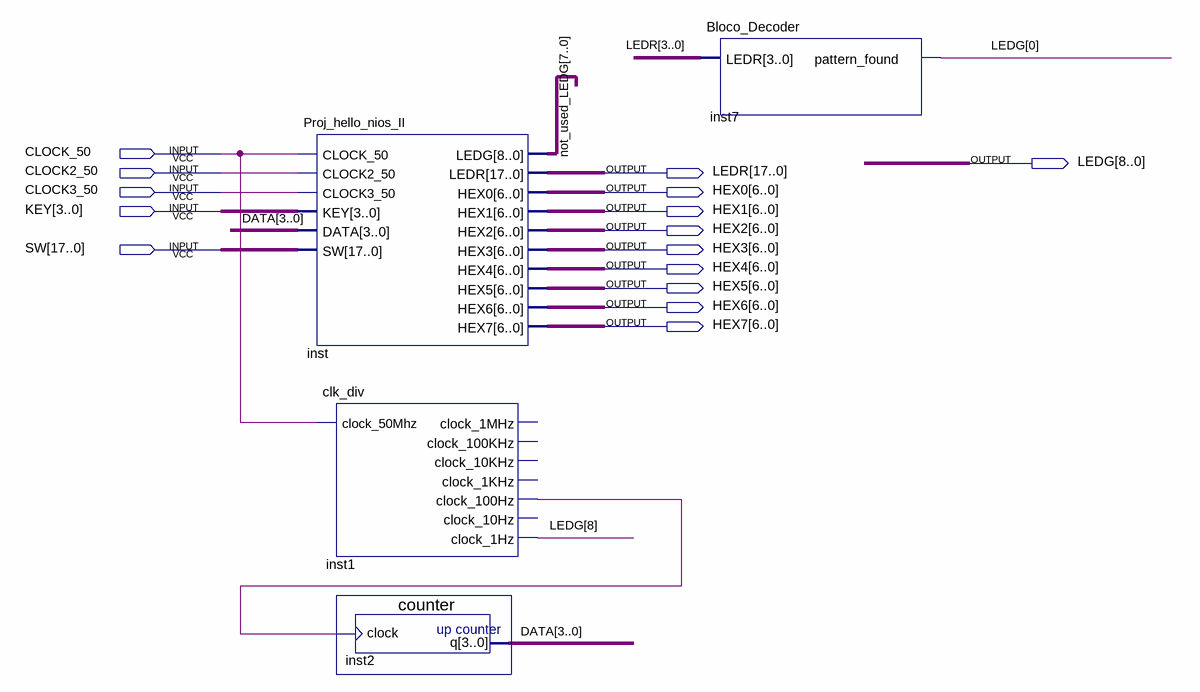
[diagram p0: schematic sheet]
// Quartus schematic Bloco_NiosII.bdf as structural Verilog: 4 symbols, 15 pins
module Bloco_NiosII (
  input  CLOCK_50,
  input  CLOCK2_50,
  input  CLOCK3_50,
  input  [3:0] KEY,
  input  [17:0] SW,
  output [8:0] LEDG,
  output [17:0] LEDR,
  output [6:0] HEX0,
  output [6:0] HEX1,
  output [6:0] HEX2,
  output [6:0] HEX3,
  output [6:0] HEX4,
  output [6:0] HEX5,
  output [6:0] HEX6,
  output [6:0] HEX7
);

  wire inst1_clock_10hz, inst1_clock_100hz;
  wire [3:0] DATA;
  wire [7:0] not_used_LEDG;

  Proj_hello_nios_II inst (
    .CLOCK_50(CLOCK_50), .CLOCK2_50(CLOCK2_50), .CLOCK3_50(CLOCK3_50), .KEY(KEY), .DATA(DATA), .SW(SW),
    .LEDG(not_used_LEDG), .LEDR(LEDR), .HEX0(HEX0), .HEX1(HEX1), .HEX2(HEX2), .HEX3(HEX3), .HEX4(HEX4),
    .HEX5(HEX5), .HEX6(HEX6), .HEX7(HEX7));
  clk_div inst1 (
    .clock_50Mhz(CLOCK_50), .clock_100Hz(inst1_clock_100hz), .clock_10Hz(inst1_clock_10hz),
    .clock_1Hz(LEDG[8]));  // open: clock_1MHz, clock_100KHz, clock_10KHz, clock_1KHz
  counter inst2 (.clock(inst1_clock_100hz), .q(DATA));
  Bloco_Decoder inst7 (.LEDR(LEDR[3:0]), .pattern_found(LEDG[0]));
endmodule
